# EAGLE schematic Atari_Joy_Port_Parallel (EAGLE 9.4.0)
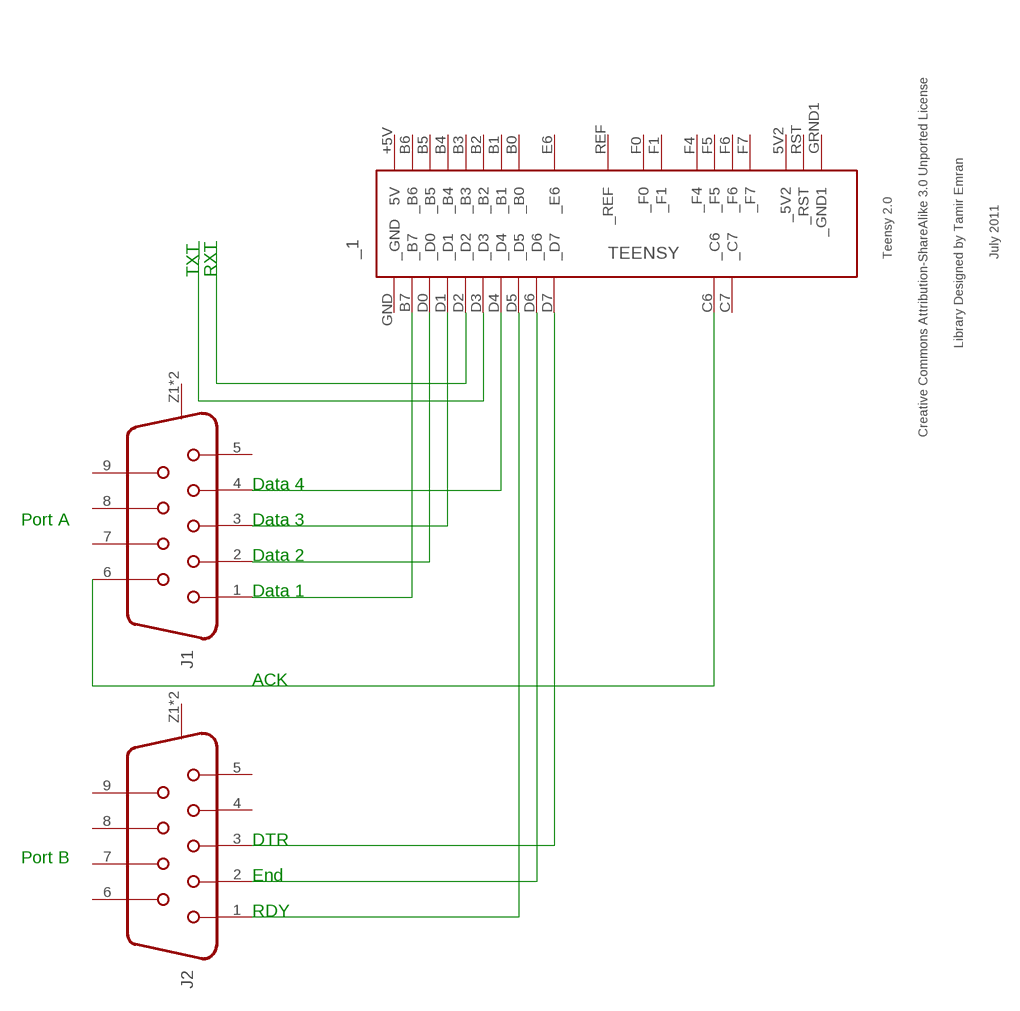
[diagram p0: schematic, sheet 1]

## Parts
_1  TEENSY  [TEENSY]
J1  618009211821  [618009211821]
J2  618009211821  [618009211821]

## Nets
N$1: _1.B7(_B7) J1.1
N$2: _1.D0(_D0) J1.2
N$4: _1.D1(_D1) J1.3
N$5: _1.D4(_D4) J1.4
N$7: _1.D5(_D5) J2.1
N$8: _1.D6(_D6) J2.2
N$9: _1.D7(_D7) J2.3
N$10: _1.C6(_C6) J1.6
N$11: _1.D2(_D2)
N$12: _1.D3(_D3)
Unconnected: _1.5V2(_5V2) _1.+5V(5V) _1.B0(_B0) _1.B1(_B1) _1.B2(_B2) _1.B3(_B3) _1.B4(_B4) _1.B5(_B5) _1.B6(_B6) _1.C7(_C7) _1.E6(_E6) _1.F0(_F0) _1.F1(_F1) _1.F4(_F4) _1.F5(_F5) _1.F6(_F6) _1.F7(_F7) _1.GND(_GND) _1.GRND1(_GND1) _1.REF(_REF) _1.RST(_RST) J1.5 J1.7 J1.8 J1.9 J1.Z1(SHIELD) J1.Z2(SHIELD) J2.4 J2.5 J2.6 J2.7 J2.8 J2.9 J2.Z1(SHIELD) J2.Z2(SHIELD)

## Notes on the sheet
- TXT | RXT
- Data 4
- Port A | Data 3
- Data 2
- Data 1
- ACK
- DTR
- Port B
- End
- RDY

## Library data of the parts
_1 = teensy:TEENSY: Teensy 2.0 Original Design by Clint Fisher Modified Design by Tamir Emran Licensed Under Creative Commons Attribution-ShareAlike 3.0 Unported (CC BY-SA 3.0)
J1 J2 = Wurth_Elektronik_Electromechanic_Input-Output_Connectors_rev19a:618009211821: WR-DSUB 8.08mm Female Angled PCB Connector without Hex Screw, 9 Pins=>Code : Con_I-O_DSUB_PCB_Female_wo-screw_6180xx211821 <http://katalog.we-online.de/media/images/eican/Con_I-O_DSUB_PCB_Female_wo-screw_6180xx211821_pf2.jpg> Details see: http://katalog.we-online.de/en/em/DSUB_FEMALE_ANGLED_PCB_CONNECTOR_W_O_HEX_SCREW_8_08MM_6180XX211821 Created 2014-07-10, Karrer Zheng 2014 (C) Würth Elektronik

## Net classes
0 default: width 1.2 mm, drill 0.9 mm, clearance 0.025 mm